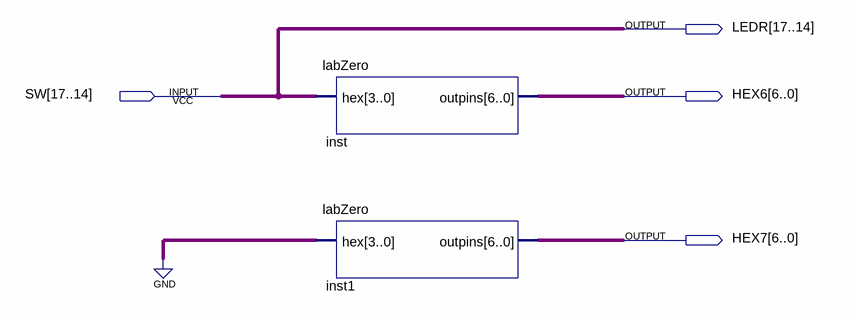
[diagram p0: schematic sheet]
// Quartus schematic labZe.bdf as structural Verilog: 2 symbols, 4 pins
module labZe (
  input  [17:14] SW,
  output [17:14] LEDR,
  output [6:0] HEX6,
  output [6:0] HEX7
);

  labZero inst (.hex(SW), .outpins(HEX6));
  labZero inst1 (.hex(4'b0000), .outpins(HEX7));

  assign LEDR = SW;
endmodule
